# Altium project TRACTIAN_IoT.PrjPcb (part 3 of 3)

## Sheet SD.SchDoc
size A4; SheetNumber: 4; SheetTotal: 4
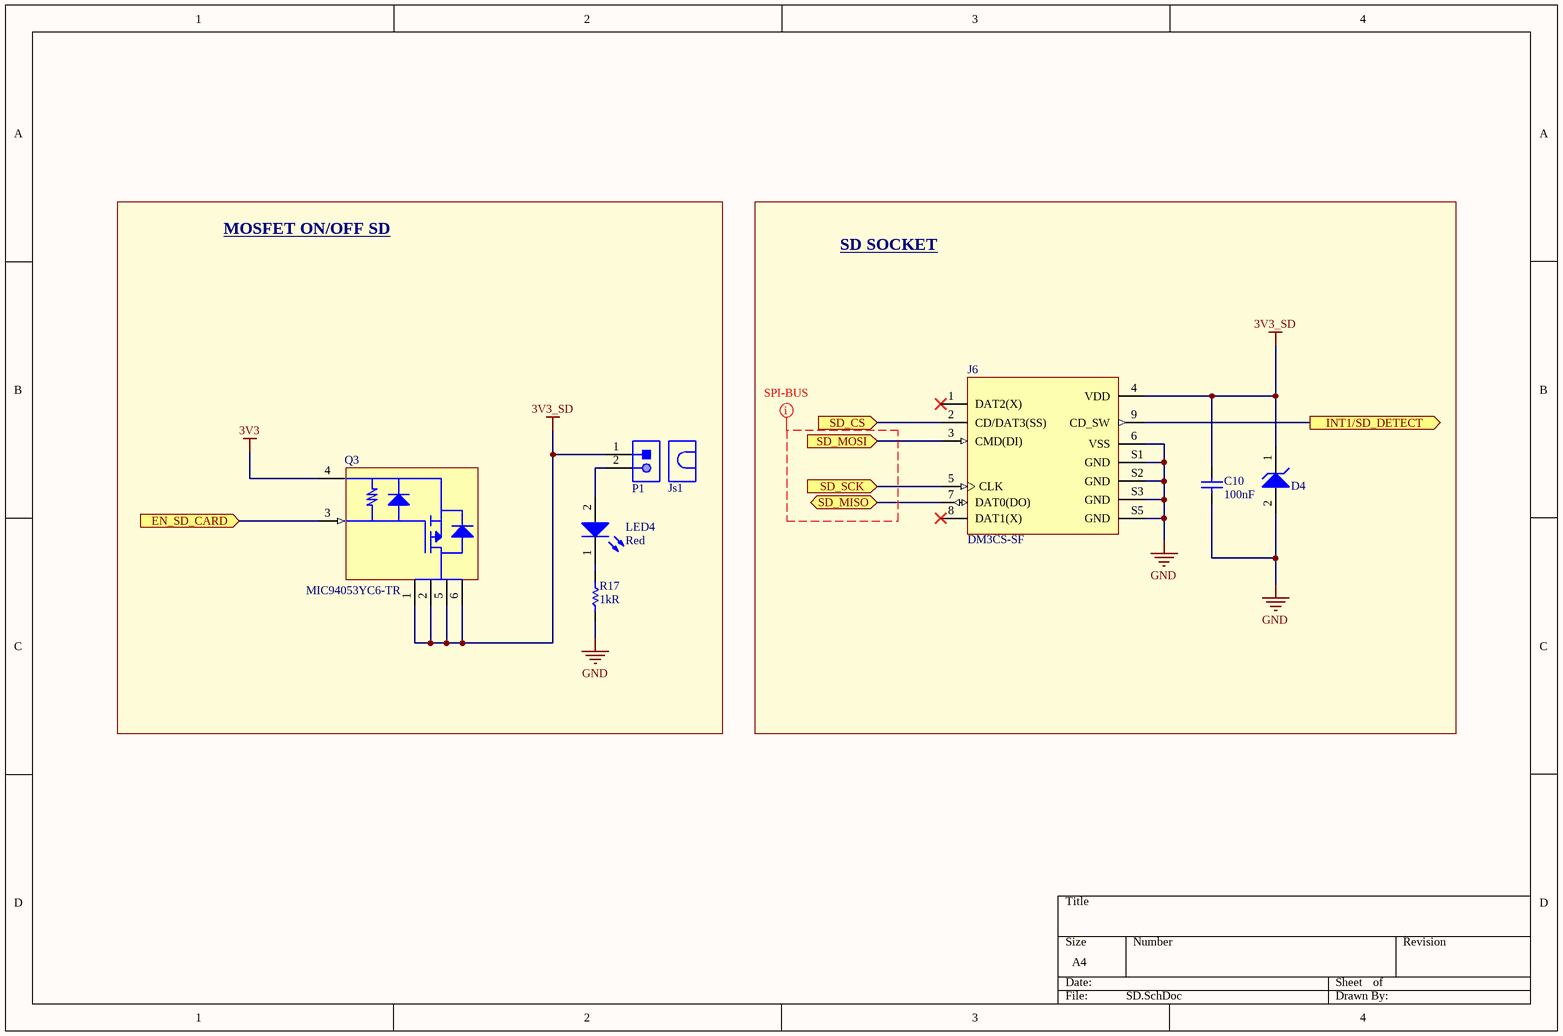
[diagram p3: SD.SchDoc]

### Parts
C10  100nF  [Cap 0805 (2012 Metric)]
D4  Diode  [Diode SOD123]  (value not drawn)
J6  DM3CS-SF  [SDHolder]
Js1  Jumper (2x1)  [Header JMP 2x1]  (value not drawn)
LED4  Red  [LED 0805(2012 METRIC)]
P1  Header 2x1  [Header 2x1]  (value not drawn)
Q3  MIC94053YC6-TR  [SC-70-6]
R17  1kR  [Res 0805 (2012 Metric)]

### Blocks framed on the sheet
MOSFET ON/OFF SD: Js1 LED4 P1 Q3 R17
SD SOCKET: C10 D4 J6

### Ports
EN_SD_CARD (in), INT1/SD_DETECT (out), SD_CS (in), SD_MISO (bidir), SD_MOSI (in), SD_SCK (in)

### Nets
3V3: Q3.4(S)
3V3_SD: C10.1 D4.1(K) J6.4(VDD) P1.1 Q3.1(D) Q3.2(D) Q3.5(D) Q3.6(D)
GND: C10.2 D4.2(A) J6.6(VSS) J6.S1(GND) J6.S2(GND) J6.S3(GND) J6.S5(GND) R17.2
IO4: J6.9(CD_SW) ; port INT1/SD_DETECT
IO5: J6.2(CD/DAT3(SS)) ; port SD_CS
IO13: Q3.3(G) ; port EN_SD_CARD
IO18: J6.5(CLK) ; port SD_SCK
IO19: J6.7(DAT0(DO)) ; port SD_MISO
IO23: J6.3(CMD(DI)) ; port SD_MOSI
NetLED4_1: LED4.1(K) R17.1
NetLED4_2: LED4.2(A) P1.2

Not connected (* = marked no-connect by the designer): J6 1(DAT2(X))* 8(DAT1(X))*

### Layout directives
net class SPI-BUS: (no net found under the mark)

### Library data of the parts
C10 = Capacitor: YAGEO (PHYCOMP)         CC0805ZRY5V9BB104             SMD Multilayer Ceramic Capacitor, 0805 [2012 Metric], 0.1 uF, 50 V, +80%, -20%, Y5V, CC Series; Tolerance: 80%; Voltage Rating: 50V; Link: https://www.digikey.com/es/products/detail/yageo/CC0805ZRY5V9BB104/2103099?s=N4IgTCBcDaIMJwAwA5EFYBaAlAmmgagJwBCxAjIgCwgC6AvkA; Supplier 1: Digi-Key; Supplier Part Number 1: 311-1361-1-ND; Manufacturer: Yageo; Manufacturer Part Number: CC0805ZRY5V9BB104; RoHS: Yes; Category: Ceramic Capacitors; Stock 1: 92689; Pricing 1: 1=0,10000, 10=0,07000, 50=0,03800, 100=0,03100, 500=0,02214, 1000=0,01739 (USD); Mount: Surface Mount; Case/Package: 0805; Number of Pins: 2; Case Code (Metric): 2012; Case Code (Imperial): 0805; Material: Ceramic; Dielectric Material: Ceramic; Min Operating Temperature: -30°C; Max Operating Temperature: 85°C; Capacitance: 100nF; Dielectric: Y5V; Package Quantity: 1; Packaging: Tape and Reel; Voltage Rating (DC): 50V; Termination: SMD/SMT; Resistor Type: Ceramic; Series: CC; Construction: Flat; Length: 2mm; Width: 0.049inch; Height: 0.6mm; Depth: 1.25mm; Thickness: 0.024inch; Radiation Hardening: No; REACH SVHC: No SVHC; Lead Free: Lead Free; Halogen Free: Halogen Free; RoHS Compliant: Yes; ComponentLink1URL: https://datasheet.ciiva.com/144/mlccorderingcode-144209.pdf?src-supplier=Digi-Key; ComponentLink1Description: https://datasheet.ciiva.com/144/mlccorderingcode-144209.pdf?src-supplier=Digi-Key; ComponentLink2URL: https://datasheet.ciiva.com/144/mlccorderingcode-144210.pdf?src-supplier=Digi-Key; ComponentLink2Description: https://datasheet.ciiva.com/144/mlccorderingcode-144210.pdf?src-supplier=Digi-Key; ComponentLink3URL: https://datasheet.ciiva.com/144/mlccorderingcode-144211.pdf?src-supplier=Digi-Key; ComponentLink3Description: https://datasheet.ciiva.com/144/mlccorderingcode-144211.pdf?src-supplier=Digi-Key; ComponentLink4URL: https://datasheet.ciiva.com/11465/upy-gphc-y5v-6-3v-to-50v-5-11465865.pdf?src-supplier=Avnet; ComponentLink4Description: https://datasheet.ciiva.com/11465/upy-gphc-y5v-6-3v-to-50v-5-11465865.pdf?src-supplier=Avnet; ComponentLink5URL: https://datasheet.ciiva.com/13389/upy-gp-np0-16v-to-50v-8-13389351.pdf?src-supplier=Mouser; ComponentLink5Description: https://datasheet.ciiva.com/13389/upy-gp-np0-16v-to-50v-8-13389351.pdf?src-supplier=Mouser; ComponentLink6URL: https://datasheet.ciiva.com/17435/upy-gphc-y5v-6-3v-to-50v-5-17435053.pdf?src-supplier=Avnet+Europe; ComponentLink6Description: https://datasheet.ciiva.com/17435/upy-gphc-y5v-6-3v-to-50v-5-17435053.pdf?src-supplier=Avnet+Europe; ComponentLink7URL: https://datasheet.ciiva.com/15189/getdatasheetpartid-55882-15189238.pdf?src-supplier=Verical; ComponentLink7Description: https://datasheet.ciiva.com/15189/getdatasheetpartid-55882-15189238.pdf?src-supplier=Verical; ComponentLink8URL: https://datasheet.ciiva.com/16747/upy-gphc-y5v-6-3v-to-50v-5-revised-16747323.pdf?src-supplier=Future+Electronics; ComponentLink8Description: https://datasheet.ciiva.com/16747/upy-gphc-y5v-6-3v-to-50v-5-revised-16747323.pdf?src-supplier=Future+Electronics; ComponentLink9URL: https://datasheet.ciiva.com/28450/1132289-28450870.pdf?src-supplier=Element14; ComponentLink9Description: https://datasheet.ciiva.com/28450/1132289-28450870.pdf?src-supplier=Element14; ComponentLink10URL: https://datasheet.ciiva.com/29241/445331-da-01-en-kerko-chip-0805-y5v0-1uf-20-80proz50vg-29241946.pdf?src-supplier=Conrad; ComponentLink10Description: https://datasheet.ciiva.com/29241/445331-da-01-en-kerko-chip-0805-y5v0-1uf-20-80proz50vg-29241946.pdf?src-supplier=Conrad
D4 = Diode: DIODE GEN PURP 75V 150MA 0603; Manufacturer: Taiwan Semiconductor; Manufacturer Part Number: TS4148CRZG; Forward Voltage: 1.25V; Peak Non-Repetitive Surge Current: 800mA; Element Configuration: Single; Max Forward Surge Current (Ifsm): 2A; Reverse Recovery Time: 4ns; Link: https://www.digikey.com/es/products/detail/taiwan-semiconductor-corporation/TS4148C-RZG/7359811?s=N4IgTCBcDaICoGUAsBGJAOAwgJQFoHEQBdAXyA; Supplier 1: Digi-Key; Supplier Part Number 1: TS4148CRZGCT-ND; RoHS: Yes; Category: Uncategorized; Stock 1: 278970; Pricing 1: 1=0,39000, 10=0,29400, 100=0,16640, 500=0,11022, 1000=0,08450, 2000=0,07348 (USD); Mount: Surface Mount; Case/Package: SMD/SMT; Number of Pins: 2; Min Operating Temperature: -55°C; Max Operating Temperature: 150°C; Packaging: Tape and Reel; Package Quantity: 5000; Max Repetitive Reverse Voltage (Vrrm): 75V; Radiation Hardening: No; RoHS Compliant: Yes; ComponentLink1URL: https://datasheet.ciiva.com/18168/getdatasheetpartid-464901-18168310.pdf?src-supplier=Verical; ComponentLink1Description: https://datasheet.ciiva.com/18168/getdatasheetpartid-464901-18168310.pdf?src-supplier=Verical
J6 = SDHolder: 10 (8 + 2) Position Card Connector Secure Digital - microSD™ Surface Mount, Right Angle Gold; Manufacturer: Hirose; Max Current Rating: 500mA; Number of Contacts: 8; Connector Type: Connector,Socket; Insulation Resistance: 1GR; Contact Resistance: 100mR; Voltage Rating (AC): 125V; Gender: Female; Pitch: 1.1mm; Link: https://www.digikey.com/product-detail/en/hirose-electric-co-ltd/DM3CS-SF/HR1972CT-ND/2602740; Supplier 1: Digi-Key; Supplier Part Number 1: HR1972DKR-ND; Manufacturer Part Number: DM3CS-SF; RoHS: Yes; Category: Memory Connectors; Stock 1: 6683; Pricing 1: 1=1,51000, 10=1,37400, 25=1,29040, 50=1,23420, 100=1,17810, 250=1,06592, 500=0,98176 (USD); Mount: Surface Mount; Contact Material: Gold,Copper Alloy,Copper; Contact Plating: Gold; Housing Material: Polymer; Min Operating Temperature: -25°C; Max Operating Temperature: 85°C; Orientation: Right Angle; Number of Rows: 1; Termination: Solder; Package Quantity: 1; Packaging: Tape and Reel; Number of Positions: 8; Current Rating: 500mA; Length: 14.1mm; Depth: 1.83mm; Width: 13.8mm; Radiation Hardening: No; Flammability Rating: UL94 V-0; Lead Free: Lead Free; REACH SVHC: Unknown; ComponentLink1URL: https://datasheet.ciiva.com/683/e60900232-683360.pdf?src-supplier=Digi-Key; ComponentLink1Description: https://datasheet.ciiva.com/683/e60900232-683360.pdf?src-supplier=Digi-Key; ComponentLink2URL: https://datasheet.ciiva.com/4581/e60900232-38395-4581034.pdf?src-supplier=Mouser; ComponentLink2Description: https://datasheet.ciiva.com/4581/e60900232-38395-4581034.pdf?src-supplier=Mouser; ComponentLink3URL: https://datasheet.ciiva.com/16434/e60900232-16434058.pdf?src-supplier=Future+Electronics; ComponentLink3Description: https://datasheet.ciiva.com/16434/e60900232-16434058.pdf?src-supplier=Future+Electronics; ComponentLink4URL: https://datasheet.ciiva.com/683/e60900232-683359.pdf?src-supplier=Digi-Key; ComponentLink4Description: https://datasheet.ciiva.com/683/e60900232-683359.pdf?src-supplier=Digi-Key; ComponentLink5URL: https://datasheet.ciiva.com/683/e60900232-683361.pdf?src-supplier=Digi-Key; ComponentLink5Description: https://datasheet.ciiva.com/683/e60900232-683361.pdf?src-supplier=Digi-Key; ComponentLink6URL: https://datasheet.ciiva.com/7651/1465328-7651895.pdf?src-supplier=Element14; ComponentLink6Description: https://datasheet.ciiva.com/7651/1465328-7651895.pdf?src-supplier=Element14; ComponentLink7URL: https://datasheet.ciiva.com/3122/e60900232-3122536.pdf?src-supplier=Avnet; ComponentLink7Description: https://datasheet.ciiva.com/3122/e60900232-3122536.pdf?src-supplier=Avnet
Js1 = Jumper (2x1): 2 (1 x 2) Position Shunt Connector Black Open Top 0.100" (2.54mm) Gold; Manufacturer: Sullins; Manufacturer Part Number: QPC02SXGN-RC; Number of Positions: 2; Pitch: 0.1inch; Link: https://www.digikey.com/product-detail/en/sullins-connector-solutions/QPC02SXGN-RC/S9337-ND/2618262; Supplier 1: Digi-Key; Supplier Part Number 1: S9337-ND; RoHS: Yes; Category: Connectors; Stock 1: 529611; Pricing 1: 1=0,10000, 10=0,05900, 25=0,04400, 50=0,03780, 100=0,03650, 250=0,03152, 500=0,03024, 1000=0,02646, 2500=0,02394 (USD); Case/Package: 100; Contact Plating: Gold; Package Quantity: 2000; Packaging: Bulk; Height: 0.235inch; Lead Free: Lead Free; ComponentLink1URL: https://datasheet.ciiva.com/767/284-sxgn-11510-767869.pdf?src-supplier=Digi-Key; ComponentLink1Description: https://datasheet.ciiva.com/767/284-sxgn-11510-767869.pdf?src-supplier=Digi-Key
LED4 = LED: SMD LED red 2.4 V 0805, 150080RS75000, Würth Elektronik; Manufacturer: Wurth Electronics; Luminous Intensity: 150mcd; Viewing Angle: 140°; Forward Voltage: 2V; Wavelength: 625nm; Lens Style: Clear,Rectangular; Forward Current: 30mA; Test Current: 20mA; Link: https://www.digikey.com/es/products/detail/w%C3%BCrth-elektronik/150080RS75000/4489918?s=N4IgTCBcDaIIwFYAMSAcSBKBlA7MlIAugL5A; Supplier 1: Digi-Key; Supplier Part Number 1: 732-4984-1-ND; Manufacturer Part Number: 150080RS75000; RoHS: Yes; Category: LEDs; Stock 1: 57843; Pricing 1: 1=0,18000, 50=0,16500, 100=0,14200, 500=0,12300 (USD); Mount: Surface Mount; Case/Package: 0805; Color: Red; Case Code (Metric): 2012; Case Code (Imperial): 0805; Min Operating Temperature: -40°C; Max Operating Temperature: 85°C; Package Quantity: 4000; Packaging: Tape and Reel; Dominant Wavelength: 625nm; Length: 2mm; Width: 1.25mm; Height: 0.7mm; REACH SVHC: Unknown; RoHS Compliant: Yes; ComponentLink1URL: https://datasheet.ciiva.com/22656/150080rs75000-22656961.pdf?src-supplier=Element14; ComponentLink1Description: https://datasheet.ciiva.com/22656/150080rs75000-22656961.pdf?src-supplier=Element14; ComponentLink2URL: https://datasheet.ciiva.com/29279/759435-da-01-en-chipled-0805-w-kl-rot-150080rs75000-29279032.pdf?src-supplier=Conrad; ComponentLink2Description: https://datasheet.ciiva.com/29279/759435-da-01-en-chipled-0805-w-kl-rot-150080rs75000-29279032.pdf?src-supplier=Conrad
P1 = Header 2x1: Connector Header Through Hole 2 position 0.100" (2.54mm); Manufacturer: Amphenol FCI; Manufacturer Part Number: 68001-402HLF; Number of Contacts: 2; Connector Type: Male Pin; Insulation Resistance: 5GR; Max Voltage Rating (AC): 1.5kV; Gender: Male; Current Rating: 3A; Contact Post Length: 3.05mm; Link: https://www.digikey.com/product-detail/en/amphenol-icc-fci/68001-402HLF/609-3507-ND/1530472; Supplier 1: Digi-Key; Supplier Part Number 1: 609-3507-ND; RoHS: Yes; Category: Headers and Wire Housings; Stock 1: 5598; Pricing 1: 1=0,12000, 10=0,11600, 100=0,07160, 500=0,05928, 1000=0,05187, 5000=0,04446, 10000=0,04323 (USD); Mount: Through Hole; Contact Plating: Tin; Housing Material: Thermoplastic; Housing Color: Black; Color: Black; Contact Material: Bronze; Min Operating Temperature: -65°C; Max Operating Temperature: 125°C; Termination: Solder; Number of Rows: 1; Number of Positions: 2; Orientation: Straight; Package Quantity: 100; Packaging: Bulk; Contact Gender: Male; Voltage Rating: 1.5kV; Length: 5.08mm; Pitch: 2.54mm; Contact Mating Length: 0.23inch; Depth: 2.41mm; Radiation Hardening: No; REACH SVHC: No SVHC; Flammability Rating: UL94 V-0; Lead Free: Lead Free; ComponentLink1URL: https://datasheet.ciiva.com/724/68000-724389.pdf?src-supplier=Digi-Key; ComponentLink1Description: https://datasheet.ciiva.com/724/68000-724389.pdf?src-supplier=Digi-Key; ComponentLink2URL: https://datasheet.ciiva.com/16726/68000-16726185.pdf?src-supplier=Avnet+Europe; ComponentLink2Description: https://datasheet.ciiva.com/16726/68000-16726185.pdf?src-supplier=Avnet+Europe; ComponentLink3URL: https://datasheet.ciiva.com/10149/68000-10149338.pdf?src-supplier=Avnet; ComponentLink3Description: https://datasheet.ciiva.com/10149/68000-10149338.pdf?src-supplier=Avnet; ComponentLink4URL: https://datasheet.ciiva.com/46385/1748756-46385306.pdf?src-supplier=Element14; ComponentLink4Description: https://datasheet.ciiva.com/46385/1748756-46385306.pdf?src-supplier=Element14
Q3 = TransistorMosfet(Load): P-Channel 6V 2A (Ta) 270mW (Ta) Surface Mount SC-70-6; Manufacturer: Microchip; Link: https://www.digikey.com/product-detail/en/microchip-technology/MIC94053YC6-TR/576-2939-1-ND/1822099; Supplier 1: Digi-Key; Supplier Part Number 1: 576-2939-1-ND; Manufacturer Part Number: MIC94053YC6-TR; RoHS: Yes; Category: MOSFETs; Stock 1: 3005; Pricing 1: 1=0,58000, 25=0,48000, 100=0,46250 (USD); ComponentLink1URL: https://datasheet.ciiva.com/6379/mic94052-53-6379193.pdf?src-supplier=Digi-Key; ComponentLink1Description: https://datasheet.ciiva.com/6379/mic94052-53-6379193.pdf?src-supplier=Digi-Key; ComponentLink2URL: https://datasheet.ciiva.com/6379/mic94052-53-6379189.pdf?src-supplier=Digi-Key; ComponentLink2Description: https://datasheet.ciiva.com/6379/mic94052-53-6379189.pdf?src-supplier=Digi-Key; ComponentLink3URL: https://datasheet.ciiva.com/46408/264781-46408581.pdf?src-supplier=Element14; ComponentLink3Description: https://datasheet.ciiva.com/46408/264781-46408581.pdf?src-supplier=Element14; ComponentLink4URL: https://datasheet.ciiva.com/15200/getdatasheetpartid-111629-15200795.pdf?src-supplier=Verical; ComponentLink4Description: https://datasheet.ciiva.com/15200/getdatasheetpartid-111629-15200795.pdf?src-supplier=Verical
R17 = Resistor: RES 1K OHM 1% 1/4W 0805; Manufacturer: Stackpole Electronics; Manufacturer Part Number: RNCP0805FTD1K00; Power Rating: 250mW; Temperature Coefficient: 100ppm/°C; Link: https://www.digikey.com/es/products/detail/stackpole-electronics-inc/RNCP0805FTD1K00/2240229?s=N4IgTCBcDaIEoDkDCAFADADjQVgGIBUARARgGk00QBdAXyA; Supplier 1: Digi-Key; Supplier Part Number 1: RNCP0805FTD1K00CT-ND; RoHS: Yes; Category: Chip SMD Resistors; Stock 1: 316834; Pricing 1: 1=0,10000, 10=0,07000, 100=0,02830, 1000=0,01272, 2500=0,01104 (USD); Mount: Surface Mount; Case/Package: 0805; Case Code (Metric): 2012; Case Code (Imperial): 0805; Size Code: 0805; Min Operating Temperature: -55°C; Max Operating Temperature: 155°C; Tolerance: 1%; Resistance: 1kR; Packaging: Tape and Reel; Resistor Type: Thin Film; Number of Terminations: 2; Max Power Dissipation: 250mW; Features: Moisture Resistant,Anti-Sulfur; Series: RNCP; Length: 0.079inch; Width: 0.049inch; Height: 0.024inch; Lead Free: Lead Free; RoHS Compliant: Yes; ComponentLink1URL: https://www.seielect.com/catalog/SEI-Packaging.pdf?src-supplier=Digi-Key; ComponentLink1Description: https://www.seielect.com/catalog/SEI-Packaging.pdf?src-supplier=Digi-Key; ComponentLink2URL: https://www.seielect.com/Catalog/SEI-rncp.pdf?src-supplier=Digi-Key; ComponentLink2Description: https://www.seielect.com/Catalog/SEI-rncp.pdf?src-supplier=Digi-Key; ComponentLink3URL: http://www.seielect.com/Catalog/SEI-rncp.pdf?src-supplier=Future+Electronics; ComponentLink3Description: http://www.seielect.com/Catalog/SEI-rncp.pdf?src-supplier=Future+Electronics

## Nets that join several sheets
3V3: ESP32 (5 pins), Battery_Charger (C7.1 U2.5), SD (Q3.4)
GND: ESP32 (28 pins), Battery_Charger (13 pins), SD (8 pins)
IO4: ESP32 (J2.13 MD1.26), SD (J6.9)
IO5: ESP32 (J2.10 MD1.29), SD (J6.2)
IO13: ESP32 (J1.15 MD1.16), SD (Q3.3)
IO18: ESP32 (J2.9 MD1.30), SD (J6.5)
IO19: ESP32 (J2.8 MD1.31), SD (J6.7)
IO23: ESP32 (J2.2 MD1.37), SD (J6.3)